# EAGLE design compact (EAGLE 7.3.0)
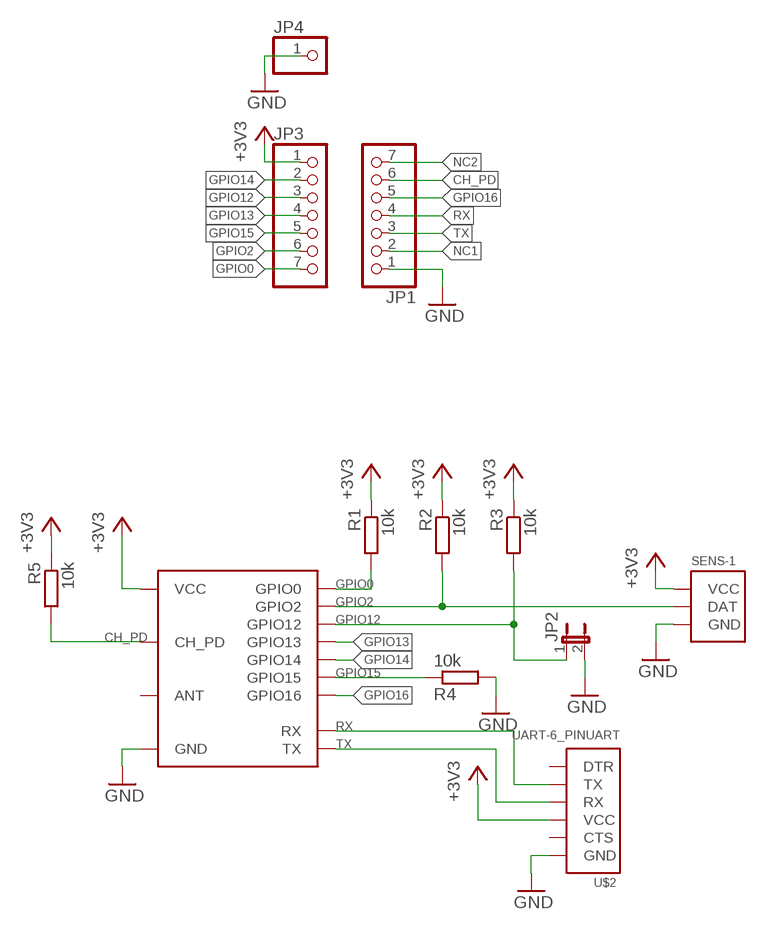
[diagram p0: schematic, sheet 1]

## Parts
JP1  PINHD-1X7  [1X07]
JP2  JP1E  [JP1]
JP3  PINHD-1X7  [1X07]
JP4  PINHD-1X1  [1X01]
R1  10k  R-EU_R0603  [R0603]
R2  10k  R-EU_R0603  [R0603]
R3  10k  R-EU_R0603  [R0603]
R4  10k  R-EU_R0603  [R0603]
R5  10k  R-EU_R0603  [R0603]
SENS-1  DHT11DHT11  [SENSOR-DHT11]
U$1  ESP8266-03  [ESP8266-ESP-03]
U$2  UART-6_PINUART  [ANGLE-1X6]

## Nets
+3V3: JP3.1 R1.1 R2.1 R3.1 R5.1 SENS-1.P$1(VCC) U$1.P$8(VCC) U$2.3(VCC)
CH_PD: JP1.6 R5.2 U$1.P$6(CH_PD)
GND: JP1.1 JP2.2 JP4.1 R4.2 SENS-1.P$4(GND) U$1.P$1(GND) U$2.1(GND)
GPIO0: JP3.7 R1.2 U$1.P$14(GPIO0)
GPIO2: JP3.6 R2.2 SENS-1.P$2(DAT) U$1.P$13(GPIO2)
GPIO12: JP2.1 JP3.3 R3.2 U$1.P$10(GPIO12)
GPIO13: JP3.4 U$1.P$11(GPIO13)
GPIO14: JP3.2 U$1.P$9(GPIO14)
GPIO15: JP3.5 R4.1 U$1.P$12(GPIO15)
GPIO16: JP1.5 U$1.P$5(GPIO16)
NC1: JP1.2
NC2: JP1.7
RX: JP1.4 U$1.P$4(RX) U$2.5(TX)
TX: JP1.3 U$1.P$3(TX) U$2.4(RX)
Unconnected: U$1.P$7(ANT) U$2.2(CTS) U$2.6(DTR)

## Library data of the parts
JP1 JP3 = pinhead:PINHD-1X7: PIN HEADER
JP2 = jumper:JP1E: JUMPER
JP4 = pinhead:PINHD-1X1: PIN HEADER
R1-R5 = p.peter-rcl:R-EU_: RESISTOR, European symbol
SENS-1 = p.peter-periphery:DHT11
U$1 = p.peter-periphery:ESP8266-03
U$2 = p.peter-connectors:UART-6_PIN: RX and TX direction as seen from outside. I.e. connect RX from connector to RX from Atmega

## Board
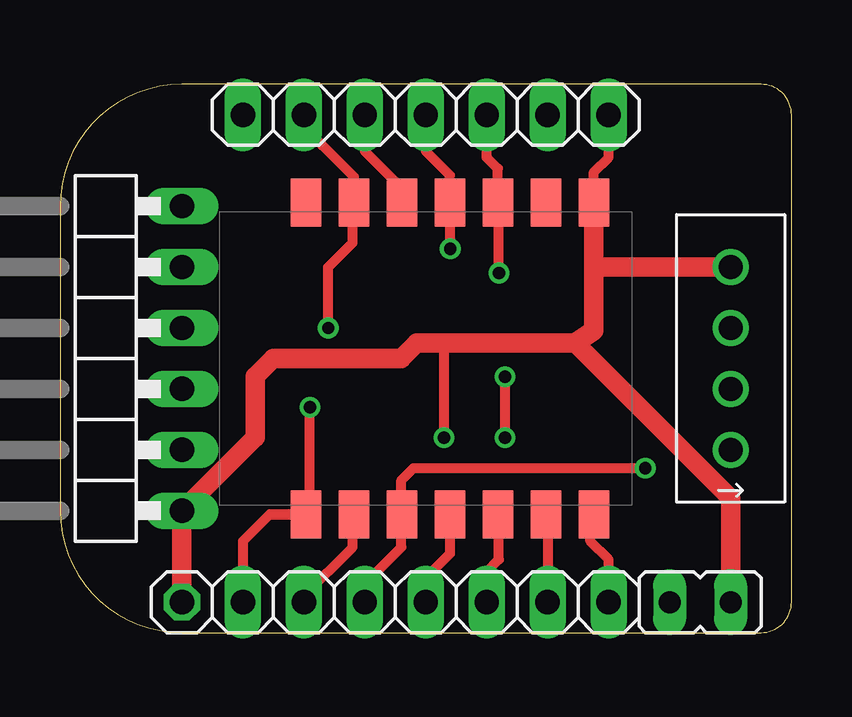
[diagram p1: board, top side]
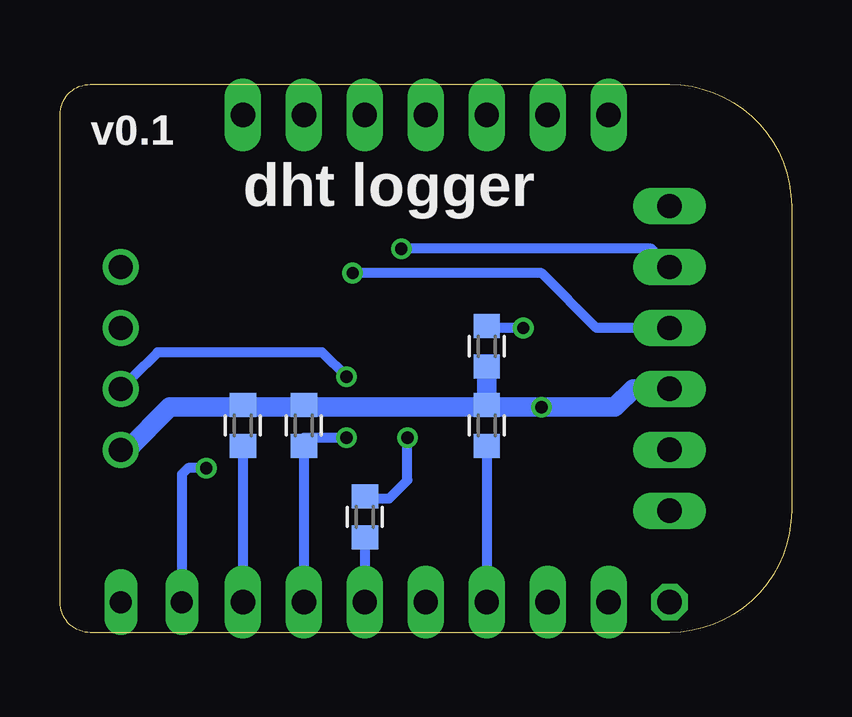
[diagram p2: board, bottom side, seen from below]

Size 30.48 x 22.86 mm. Coordinates in mm from the lower left corner, seen from the top.
Outline: 6.35,0 29.21,0 arc90 30.48,1.27 30.48,21.59 arc90 29.21,22.86 26.67,22.86 5.08,22.86 arc90 0,17.78 0,5.08 arc90 5.08,0 6.35,0
Copper layers (1*16): Top 0.0356mm / dielectric 1.5011mm / Bottom 0.0356mm
Design rules "oshpark": minimum track width 6mil, minimum drill 13mil, track to track 6mil, track to pad 6mil, pad to pad 6mil, via to via 6mil, smd to smd 6mil, copper to edge 15mil, drill to drill 6mil, minimum pad ring 7mil, minimum via ring 7mil, stop-mask expansion 4mil, vias tented up to drill 4.1mm, thermal gap 10mil

### Footprints (pad centres in the part's own frame; a part is rotated, then mirrored left to right if it is on the bottom)
1X07 = drill 1.016 long: 1 -7.62,0; 2 -5.08,0; 3 -2.54,0; 4 0,0; 5 2.54,0; 6 5.08,0; 7 7.62,0
JP1 = drill 0.914 long: 1 0,-1.27; 2 0,1.27
1X01 = drill 1.016 octagon: 1 0,0
R0603 = smd 1 x 1.1: 1 -0.85,0; 2 0.85,0
SENSOR-DHT11 = drill 1: P$1 -3.81,0; P$2 -1.27,0; P$3 1.27,0; P$4 3.81,0
ESP8266-ESP-03 = smd 1.27 x 2: P$1 7,6.5; P$2 5,6.5; P$3 3,6.5; P$4 1,6.5; P$5 -1,6.5; P$6 -3,6.5; P$7 -5,6.5; P$8 -5,-6.5; P$9 -3,-6.5; P$10 -1,-6.5; P$11 1,-6.5; P$12 3,-6.5; P$13 5,-6.5; P$14 7,-6.5
ANGLE-1X6 = drill 1.016 long: 1 -6.35,-2.54; 2 -3.81,-2.54; 3 -1.27,-2.54; 4 1.27,-2.54; 5 3.81,-2.54; 6 6.35,-2.54

### Placement (x,y rotation side)
JP1  15.24,21.59 180 top
JP2  26.67,1.27 270 top
JP3  15.24,1.27 0 top
JP4  5.08,1.27 0 top
R1  22.86,8.64 270 bottom
R2  20.32,8.64 270 bottom
R3  12.7,8.64 270 bottom
R4  17.78,4.83 90 bottom
R5  12.7,11.94 90 bottom
SENS-1  27.94,11.43 90 top
U$1  15.24,11.43 0 top
U$2  2.54,11.43 90 top
U$3  [LOGO-JUSTGEEK-XXXS-MASK]  27.94,20.32 0 top

### Tracks (layer width: path | path; a pad name or v marks a point on that pad's centre or on a via)
+3V3  (via drill 0.51)
  Top 0.406: U$1.P$8 8.74,4.93 | 8.74,4.93 7.62,3.81 JP3.1 | 8.74,4.93 10.31,4.93 10.41,4.83 v10.41,9.4
  Bottom 0.813: U$2.3 6.6,10.16 7.37,9.4 v10.41,9.4 12.7,9.4 | 12.7,9.4 20.57,9.4 | 20.57,9.4 22.35,9.4 | 22.35,9.4 22.86,9.4 R1.1 | R2.1 20.49,9.49 20.57,9.4 | 12.7,9.4 R3.1 R5.1 | SENS-1.P$1 27.69,7.62 25.91,9.4 22.35,9.4
CH_PD  (via drill 0.51)
  Top 0.406: U$1.P$6 12.24,17.57 12.19,17.53 | v11.18,12.7 11.18,15.24 12.19,16.26 12.19,17.88 U$1.P$6 | U$1.P$6 12.24,19 10.92,20.32 10.41,20.83 10.16,21.08 JP1.6
  Bottom 0.406: v11.18,12.7 12.61,12.7 R5.2
GND  (via drill 0.51)
  Top 0.406: U$1.P$1 22.24,19.19 22.86,19.81 JP1.1 | v16,8.13 16,12.06
  Top 0.813: 22.39,17.78 U$1.P$1 22.24,15.24 | JP2.2 27.94,5.59 21.46,12.06 | 22.24,15.24 22.24,12.59 21.46,12.06 | 21.46,12.06 16,12.06 14.86,12.06 14.22,11.43 8.89,11.43 8.13,10.67 8.13,8.13 U$2.1 JP4.1 | SENS-1.P$4 22.24,15.24
  Bottom 0.406: R4.2 17.44,5.5 17.53,5.59 16.76,5.59 16,6.35 v16,8.13
GPIO0
  Top 0.406: JP3.7 22.86,3.05 22.1,3.81 22.1,5.33 22.1,5.07 U$1.P$14
  Bottom 0.406: R1.2 22.86,2.03 JP3.7
GPIO2  (via drill 0.51)
  Top 0.406: U$1.P$13 20.32,4.85 JP3.6 | v18.54,8.13 v18.54,10.67
  Bottom 0.406: JP3.6 R2.2 20.32,8.13 v18.54,8.13 | v18.54,10.67 19.56,11.68 26.42,11.68 27.43,10.67 SENS-1.P$2
GPIO12  (via drill 0.51)
  Top 0.406: JP3.3 12.7,2.03 14.22,3.56 | 14.22,3.56 14.22,4.91 U$1.P$10 | 14.22,3.56 14.22,5.08 14.22,6.35 14.73,6.86 24.13,6.86 v24.38,6.86
  Bottom 0.406: R3.2 12.7,1.52 JP3.3 | v24.38,6.86 25.15,6.86 25.4,6.6 JP2.1
GPIO13
  Top 0.406: JP3.4 15.24,2.29 16.26,3.3 16.26,4.91 U$1.P$11
GPIO14
  Top 0.406: JP3.2 10.16,1.52 12.19,3.56 12.19,4.88 U$1.P$9
GPIO15
  Top 0.406: JP3.5 17.78,2.54 18.29,3.05 18.29,4.88 U$1.P$12
  Bottom 0.406: R4.1 17.78,2.54 17.78,2.03 17.78,1.78 JP3.5
GPIO16
  Top 0.406: U$1.P$5 14.24,18.53 12.7,20.07 JP1.5
RX  (via drill 0.51)
  Top 0.406: JP1.4 15.24,20.07 16.24,19.07 U$1.P$4 16.26,17.91 v16.26,16
  Bottom 0.406: U$2.5 5.84,16 v16.26,16
TX  (via drill 0.51)
  Top 0.406: JP1.3 17.78,19.81 18.24,19.35 U$1.P$3 18.29,17.88 v18.29,14.99
  Bottom 0.406: U$2.4 8.13,12.7 10.41,14.99 v18.29,14.99

### Text on the board
bPlace: v0.1 | dht logger